# Altium schematic sheet EDU_High-Speed-Design_CPU_LVDS.SchDoc: CPU LVDS
size 279 x 215 mm; Date: not used; ApprovedBy: not used; CheckedBy: not used; Author: not used; DrawnBy: not used; Organization: not used; Address4: not used; SheetNumber: 21; SheetTotal: 26; Time: not used; ImagePath: not used; Application_BuildNumber: not used
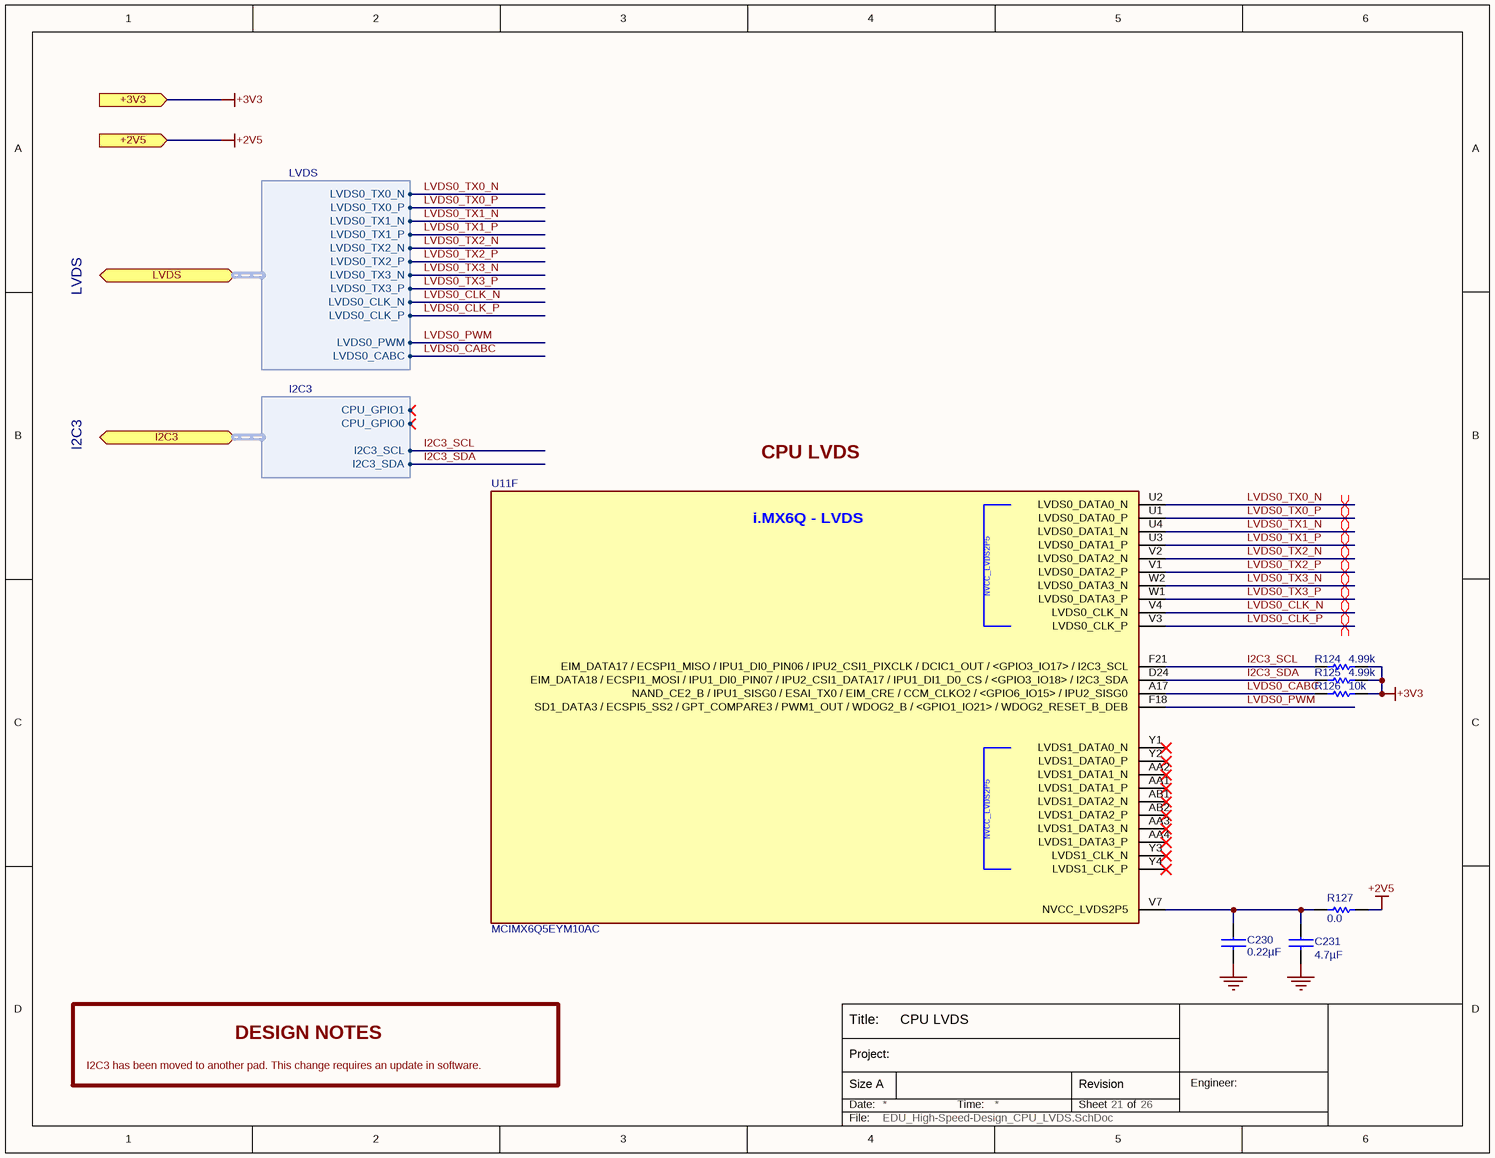
[diagram p0: EDU_High-Speed-Design_CPU_LVDS.SchDoc]

## Parts
C230  0.22µF  [C0402]
C231  4.7µF  [C0402]
R124  4.99k  [R0402]
R125  4.99k  [R0402]
R126  10k  [R0402]
R127  0.0  [R0402]
U11  MCIMX6Q5EYM10AC  [MCIMX6Q5EYM10AC]  (part F of 15)

## Ports
+2V5 (in), +3V3 (in), I2C3 (bidir, harness I2C3), LVDS (bidir, harness LVDS)

## Harnesses
LVDS: LVDS0_TX0_N, LVDS0_TX1_P, LVDS0_TX2_N, LVDS0_TX1_N, LVDS0_TX2_P, LVDS0_TX0_P, LVDS0_TX3_N, LVDS0_TX3_P, LVDS0_CLK_N, LVDS0_CLK_P, LVDS0_PWM, LVDS0_CABC
I2C3: CPU_GPIO0, I2C3_SCL, CPU_GPIO1, I2C3_SDA

## Nets
+2V5: R127.2 ; port +2V5
+3V3: R124.1 R125.1 R126.2 ; port +3V3
GND: C230.2 C231.2
I2C3_SCL: R124.2 U11.F21(EIM_DATA17_/_ECSPI1_MISO_/_IPU1_DI0_PIN06_/_IPU2_CSI1_PIXCLK_/_DCIC1_OUT_/_<GPIO3_IO17>_/_I2C3_SCL) ; port I2C3.I2C3_SCL
I2C3_SDA: R125.2 U11.D24(EIM_DATA18_/_ECSPI1_MOSI_/_IPU1_DI0_PIN07_/_IPU2_CSI1_DATA17_/_IPU1_DI1_D0_CS_/_<GPIO3_IO18>_/_I2C3_SDA) ; port I2C3.I2C3_SDA
LVDS0_CABC: R126.1 U11.A17(NAND_CE2_B_/_IPU1_SISG0_/_ESAI_TX0_/_EIM_CRE_/_CCM_CLKO2_/_<GPIO6_IO15>_/_IPU2_SISG0) ; port LVDS.LVDS0_CABC
LVDS0_CLK_N: U11.V4(LVDS0_CLK_N) ; port LVDS.LVDS0_CLK_N
LVDS0_CLK_P: U11.V3(LVDS0_CLK_P) ; port LVDS.LVDS0_CLK_P
LVDS0_PWM: U11.F18(SD1_DATA3_/_ECSPI5_SS2_/_GPT_COMPARE3_/_PWM1_OUT_/_WDOG2_B_/_<GPIO1_IO21>_/_WDOG2_RESET_B_DEB) ; port LVDS.LVDS0_PWM
LVDS0_TX0_N: U11.U2(LVDS0_DATA0_N) ; port LVDS.LVDS0_TX0_N
LVDS0_TX0_P: U11.U1(LVDS0_DATA0_P) ; port LVDS.LVDS0_TX0_P
LVDS0_TX1_N: U11.U4(LVDS0_DATA1_N) ; port LVDS.LVDS0_TX1_N
LVDS0_TX1_P: U11.U3(LVDS0_DATA1_P) ; port LVDS.LVDS0_TX1_P
LVDS0_TX2_N: U11.V2(LVDS0_DATA2_N) ; port LVDS.LVDS0_TX2_N
LVDS0_TX2_P: U11.V1(LVDS0_DATA2_P) ; port LVDS.LVDS0_TX2_P
LVDS0_TX3_N: U11.W2(LVDS0_DATA3_N) ; port LVDS.LVDS0_TX3_N
LVDS0_TX3_P: U11.W1(LVDS0_DATA3_P) ; port LVDS.LVDS0_TX3_P
NetC230_1: C230.1 C231.1 R127.1 U11.V7(NVCC_LVDS2P5)

Not connected (* = marked no-connect by the designer): U11 AA1(LVDS1_DATA1_P)* AA2(LVDS1_DATA1_N)* AA3(LVDS1_DATA3_N)* AA4(LVDS1_DATA3_P)* AB1(LVDS1_DATA2_N)* AB2(LVDS1_DATA2_P)* Y1(LVDS1_DATA0_N)* Y2(LVDS1_DATA0_P)* Y3(LVDS1_CLK_N)* Y4(LVDS1_CLK_P)*

## Layout directives
differential pair: LVDS0_CLK_N, LVDS0_CLK_P, LVDS0_TX0_N, LVDS0_TX0_P, LVDS0_TX1_N, LVDS0_TX1_P, LVDS0_TX2_N, LVDS0_TX2_P, LVDS0_TX3_N, LVDS0_TX3_P

## Notes on the sheet
- LVDS
- I2C3
- CPU LVDS
- DESIGN NOTES
- I2C3 has been moved to another pad. This change requires an update in software.
- Title:
- Date:
- Size A
- Project:
- Time:
- Sheet
- Revision
- of
- Engineer:
- File:
- (in symbol MCIMX6Q5EYM10AC, part F) i.MX6Q - LVDS

## Library data of the parts
C230 = C1005X5R1E224M: CAP CER .22UF 25V X5R 20% 0402; Manufacturer 1: TDK Corporation; Capacitance: 0.22µF; Manufacturer Part Number 1: C1005X5R1E224M; Voltage: 25V; Supplier 1: Digi-Key; Supplier Part Number 1: 445-5945-1-ND; ComponentLink1URL: http://www.tdk.co.jp/tefe02/e412_c.pdf; ComponentLink1Description: http://www.tdk.co.jp/tefe02/e412_c.pdf
C231 = C1005X5R1A475M: CAP CER 4.7UF 10V 20% X5R 0402; Manufacturer 1: TDK Corporation; Supplier 1: Digi-Key; Supplier Part Number 1: 445-8023-1-ND; Manufacturer Part Number 1: C1005X5R1A475M; Capacitance: 4.7µF; Voltage: 10V; ComponentLink1URL: http://www.tdk.com/pdf/general_B11.pdf; ComponentLink1Description: http://www.tdk.com/pdf/general_B11.pdf
R124 R125 = RMCF0402FT4K99: RES TF 4.99K OHM 1% 1/16W 0402; Manufacturer 1: Stackpole Electronics Inc; Manufacturer Part Number 1: RMCF0402FT4K99; Resistance: 4.99k; Supplier 1: Digi-Key; Supplier Part Number 1: RMCF0402FT4K99CT-ND; ComponentLink1URL: http://www.seielect.com/Catalog/SEI-RMCF.pdf; ComponentLink1Description: http://www.seielect.com/Catalog/SEI-RMCF.pdf
R126 = RC0402FR-0710KL: RES 10.0K OHM 1/16W 1% 0402 SMD; Manufacturer 1: Yageo; Manufacturer Part Number 1: RC0402FR-0710KL; Resistance: 10k; Supplier 1: Digi-Key; Supplier Part Number 1: 311-10.0KLRCT-ND; ComponentLink1URL: http://www.yageo.com/documents/recent/PYu-RC0402_51_RoHS_L_6.pdf; ComponentLink1Description: http://www.yageo.com/documents/recent/PYu-RC0402_51_RoHS_L_6.pdf
R127 = RC0402JR-070RL: RES 0.0 OHM 1/16W 0402 SMD; Manufacturer 1: Yageo; Manufacturer Part Number 1: RC0402JR-070RL; Resistance: 0.0; Supplier 1: Digi-Key; Supplier Part Number 1: 311-0.0JRCT-ND; ComponentLink1URL: http://www.yageo.com/documents/recent/PYu-RC0402_51_RoHS_L_6.pdf; ComponentLink1Description: http://www.yageo.com/documents/recent/PYu-RC0402_51_RoHS_L_6.pdf
U11 = MCIMX6Q5EYM10AC: IC MCU 32BIT ARM QUAD 624FCBGA; Manufacturer 1: Freescale Semiconductor; Supplier 1: Digi-Key; Manufacturer Part Number 1: MCIMX6Q5EYM10AC; Supplier Part Number 1: MCIMX6Q5EYM10AC-ND